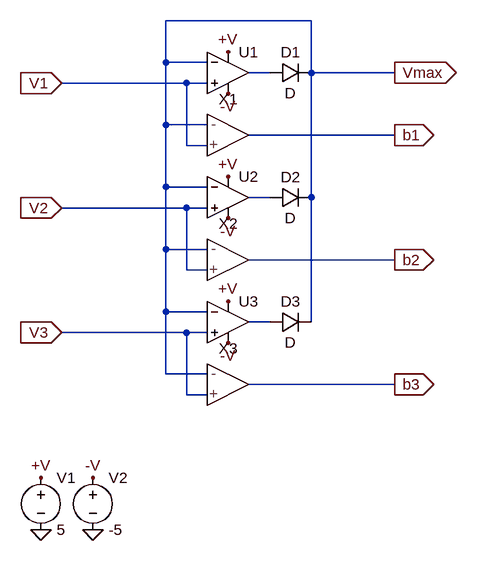
[diagram p0: schematic comparator.asc]
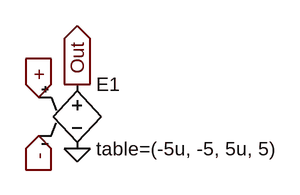
[diagram p1: sub-circuit idealopamp.asc]
comparator.asc, the LTspice schematic file:
Version 4
SHEET 1 880 680
WIRE -48 -224 -272 -224
WIRE -272 -160 -272 -224
WIRE -208 -160 -272 -160
WIRE -112 -144 -144 -144
WIRE -48 -144 -48 -224
WIRE 80 -144 -48 -144
WIRE -240 -128 -432 -128
WIRE -208 -128 -240 -128
WIRE -272 -64 -272 -160
WIRE -208 -64 -272 -64
WIRE 80 -48 -144 -48
WIRE -240 -32 -240 -128
WIRE -208 -32 -240 -32
WIRE -272 32 -272 -64
WIRE -208 32 -272 32
WIRE -112 48 -144 48
WIRE -48 48 -48 -144
WIRE -240 64 -432 64
WIRE -208 64 -240 64
WIRE -272 128 -272 32
WIRE -208 128 -272 128
WIRE 80 144 -144 144
WIRE -240 160 -240 64
WIRE -208 160 -240 160
WIRE -272 224 -272 128
WIRE -208 224 -272 224
WIRE -112 240 -144 240
WIRE -48 240 -48 48
WIRE -240 256 -432 256
WIRE -208 256 -240 256
WIRE -272 320 -272 224
WIRE -208 320 -272 320
WIRE 80 336 -144 336
WIRE -240 352 -240 256
WIRE -208 352 -240 352
FLAG 80 -144 Vmax
IOPIN 80 -144 Out
FLAG 80 -48 b1
IOPIN 80 -48 Out
FLAG 80 144 b2
IOPIN 80 144 Out
FLAG 80 336 b3
IOPIN 80 336 Out
FLAG -432 -128 V1
IOPIN -432 -128 In
FLAG -432 64 V2
IOPIN -432 64 In
FLAG -432 256 V3
IOPIN -432 256 In
FLAG -464 560 0
FLAG -384 560 0
FLAG -464 480 +V
FLAG -384 480 -V
FLAG -176 -176 +V
FLAG -176 16 +V
FLAG -176 -112 -V
FLAG -176 208 +V
FLAG -176 80 -V
FLAG -176 272 -V
SYMBOL diode -112 -128 R270
WINDOW 0 32 32 VTop 2
WINDOW 3 0 32 VBottom 2
SYMATTR InstName D1
SYMBOL diode -112 64 R270
WINDOW 0 32 32 VTop 2
WINDOW 3 0 32 VBottom 2
SYMATTR InstName D2
SYMBOL diode -112 256 R270
WINDOW 0 32 32 VTop 2
WINDOW 3 0 32 VBottom 2
SYMATTR InstName D3
SYMBOL voltage -464 464 R0
WINDOW 123 0 0 Left 0
WINDOW 39 0 0 Left 0
SYMATTR InstName V1
SYMATTR Value 5
SYMBOL voltage -384 464 R0
WINDOW 123 0 0 Left 0
WINDOW 39 0 0 Left 0
SYMATTR InstName V2
SYMATTR Value -5
SYMBOL IdealOpAmp -176 144 R0
SYMATTR InstName X2
SYMBOL IdealOpAmp -176 336 R0
SYMATTR InstName X3
SYMBOL IdealOpAmp -176 -48 R0
SYMATTR InstName X1
SYMBOL OpAmps\\UniversalOpAmp1 -176 -144 R0
SYMATTR InstName U1
SYMATTR Value2 Avol=1Meg GBW=10g Vos=0
SYMBOL OpAmps\\UniversalOpAmp1 -176 48 R0
SYMATTR InstName U2
SYMATTR Value2 Avol=1Meg GBW=10g Vos=0
SYMBOL OpAmps\\UniversalOpAmp1 -176 240 R0
SYMATTR InstName U3
SYMATTR Value2 Avol=1Meg GBW=10g Vos=0

idealopamp.asc, the sub-circuit schematic file:
Version 4
SHEET 1 880 680
FLAG 208 192 0
FLAG 160 128 +
IOPIN 160 128 In
FLAG 160 176 -
IOPIN 160 176 In
FLAG 208 112 Out
IOPIN 208 112 Out
SYMBOL e 208 96 R0
SYMATTR InstName E1
SYMATTR Value table=(-5u, -5, 5u, 5)

The netlist it stands for:
* comparator.asc
D1 N001 Vmax D
D2 N002 Vmax D
D3 N003 Vmax D
V1 +V 0 5
V2 -V 0 -5
XX2 V2 Vmax b2 idealopamp
XX3 V3 Vmax b3 idealopamp
XX1 V1 Vmax b1 idealopamp
XU1 V1 Vmax +V -V N001 level1 Avol=1Meg GBW=10g Vos=0 En=0 Enk=0 In=0 Ink=0 Rin=500Meg  ; pins In+ In- V+ V- OUT
XU2 V2 Vmax +V -V N002 level1 Avol=1Meg GBW=10g Vos=0 En=0 Enk=0 In=0 Ink=0 Rin=500Meg  ; pins In+ In- V+ V- OUT
XU3 V3 Vmax +V -V N003 level1 Avol=1Meg GBW=10g Vos=0 En=0 Enk=0 In=0 Ink=0 Rin=500Meg  ; pins In+ In- V+ V- OUT

* block symbol definitions
.subckt idealopamp + - Out
E1 Out 0 + - table=(-5u, -5, 5u, 5)
.ends idealopamp

.model D D
.lib standard.dio
.lib UniversalOpAmp1.lib
.backanno
.end